# EAGLE schematic gyro (EAGLE 7.2.0)
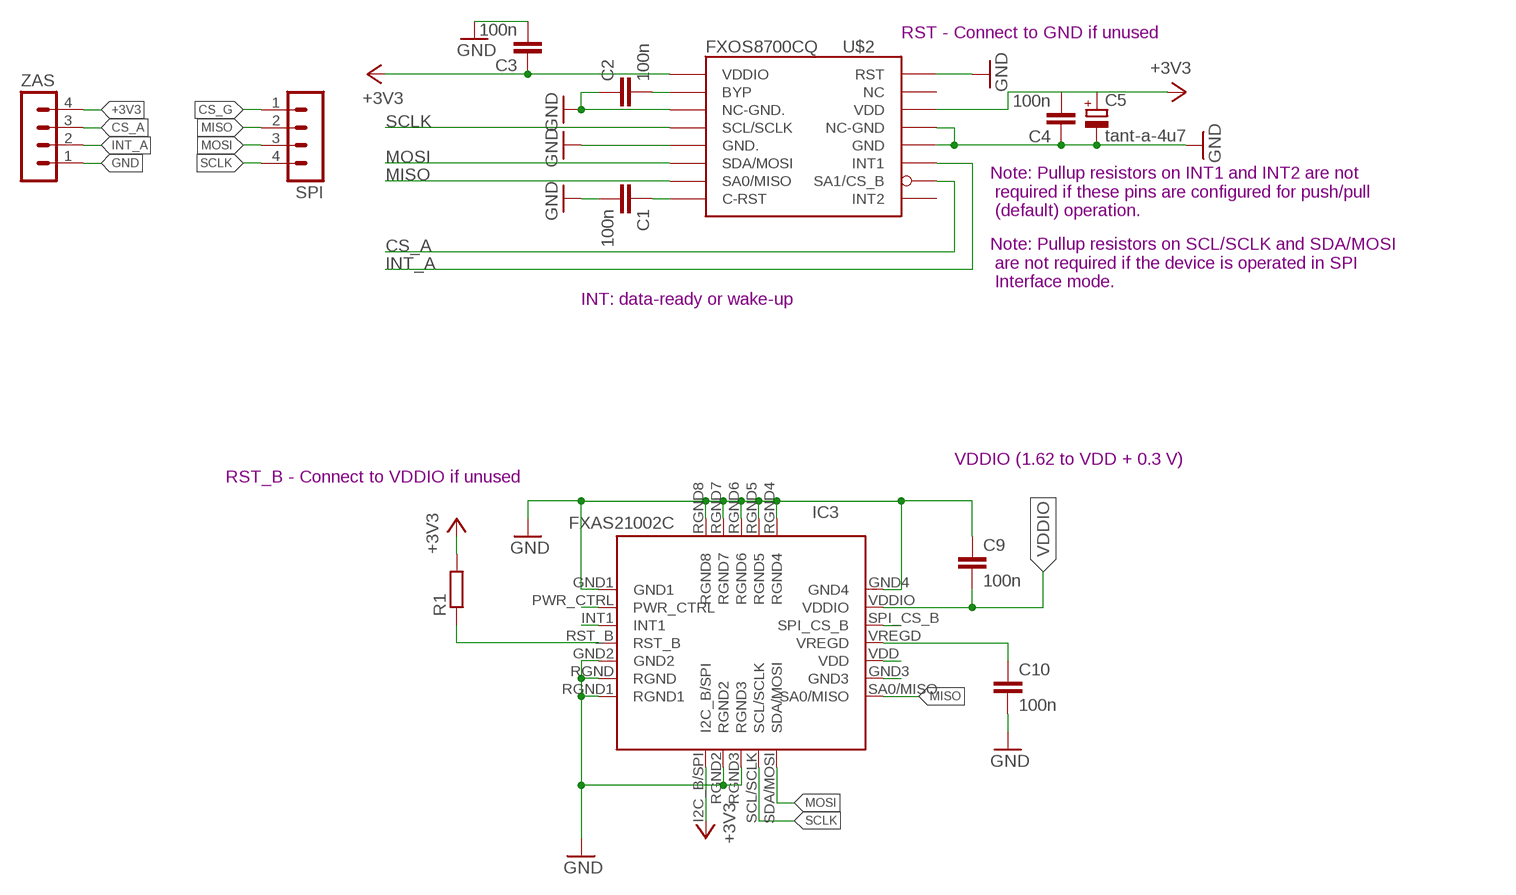
[diagram p0: schematic, sheet 1]

## Parts
C1  100n  C-EUC0603  [C0603]
C2  100n  C-EUC0603  [C0603]
C3  100n  C-EUC0603  [C0603]
C4  100n  C-EUC0603  [C0603]
C5  tant-a-4u7  CPOL-EUSMCA  [SMC_A]
C9  100n  C-EUC0603  [C0603]
C10  100n  C-EUC0603  [C0603]
IC3  FXAS21002C  [QFN24-4X4]
R1  R-EU_R0603  [R0603]
SPI  MA04-1  [MA04-1]
U$2  FXOS8700CQR1  [QFN16-5X3]
ZAS  MA04-1  [MA04-1]

## Nets
+3V3: C3.1 C4.2 C5.+ IC3.I2C_B/SPI IC3.VDD R1.2 U$2.P$1(VDDIO) U$2.P$14(VDD) ZAS.4
CS_A: U$2.P$10(SA1/CS_B) ZAS.3
CS_G: IC3.SPI_CS_B SPI.1
GND: C1.2 C2.1 C3.2 C4.1 C5.- C9.1 C10.2 IC3.GND1 IC3.GND2 IC3.GND3 IC3.GND4 IC3.RGND IC3.RGND1 IC3.RGND2 IC3.RGND3 IC3.RGND4 IC3.RGND5 IC3.RGND6 IC3.RGND7 IC3.RGND8 U$2.P$3(NC-GND.) U$2.P$5(GND.) U$2.P$12(GND) U$2.P$13(NC-GND) U$2.P$16(RST) ZAS.1
INT_A: U$2.P$11(INT1) ZAS.2
INT_G: IC3.INT1
MISO: IC3.SA0/MISO SPI.2 U$2.P$7(SA0/MISO)
MOSI: IC3.SDA/MOSI SPI.3 U$2.P$6(SDA/MOSI)
N$6: C1.1 U$2.P$8(C-RST)
N$7: C2.2 U$2.P$2(BYP)
N$26: C10.1 IC3.VREGD
N$27: IC3.PWR_CTRL
N$30: IC3.RST_B R1.1
SCLK: IC3.SCL/SCLK SPI.4 U$2.P$4(SCL/SCLK)
VDDIO: C9.2 IC3.VDDIO
Unconnected: U$2.P$9(INT2) U$2.P$15(NC)

## Notes on the sheet
- RST - Connect to GND if unused
- Note: Pullup resistors on INT1 and INT2 are not
   required if these pins are configured for push/pull
   (default) operation.
- Note: Pullup resistors on SCL/SCLK and SDA/MOSI
   are not required if the device is operated in SPI
   Interface mode.
- INT: data-ready or wake-up
- VDDIO (1.62 to VDD + 0.3 V)
- RST_B - Connect to VDDIO if unused

## Library data of the parts
C1-C4 C9 C10 = rcl:C-EU: CAPACITOR, European symbol
C5 = rcl:CPOL-EU: POLARIZED CAPACITOR, European symbol
IC3 = _microMouse:FXAS21002C
R1 = rcl:R-EU_: RESISTOR, European symbol
SPI ZAS = con-lstb:MA04-1: PIN HEADER; OC_FARNELL: unknown; OC_NEWARK: unknown
U$2 = _microMouse:FXOS8700CQ: 6D 6axis sensor - 3D accelerator and 3D magnetometer